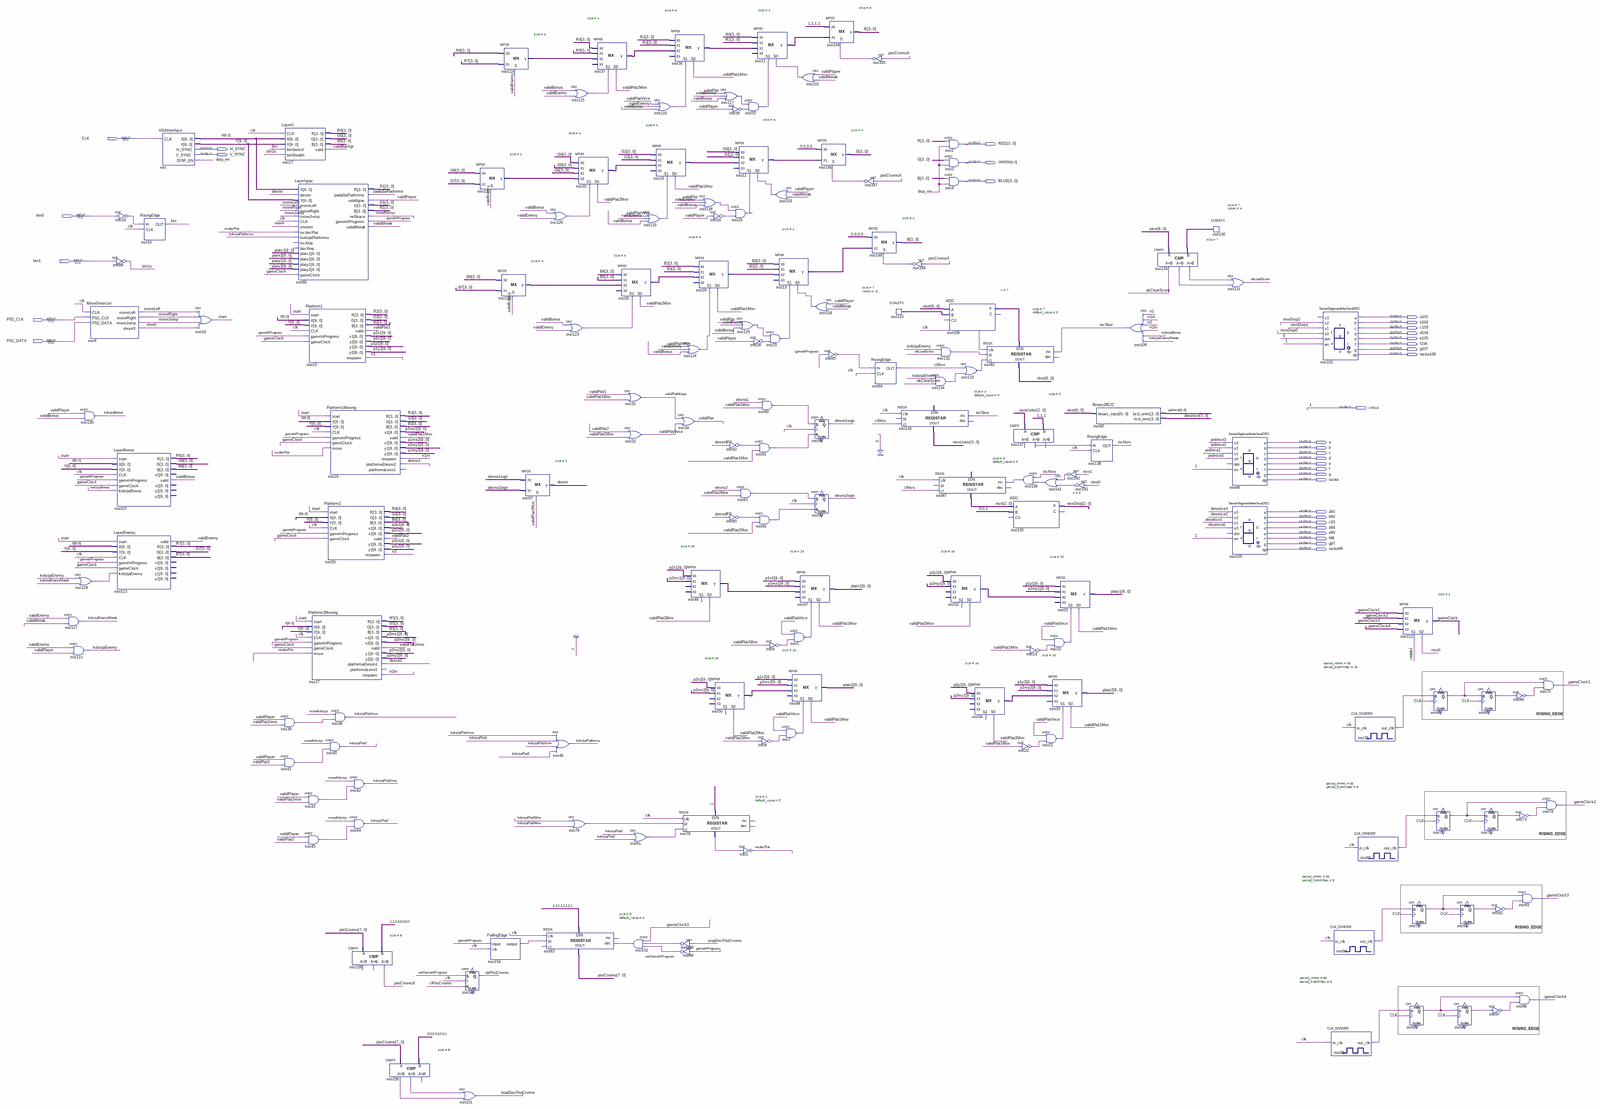
[diagram p0: schematic sheet, whole]
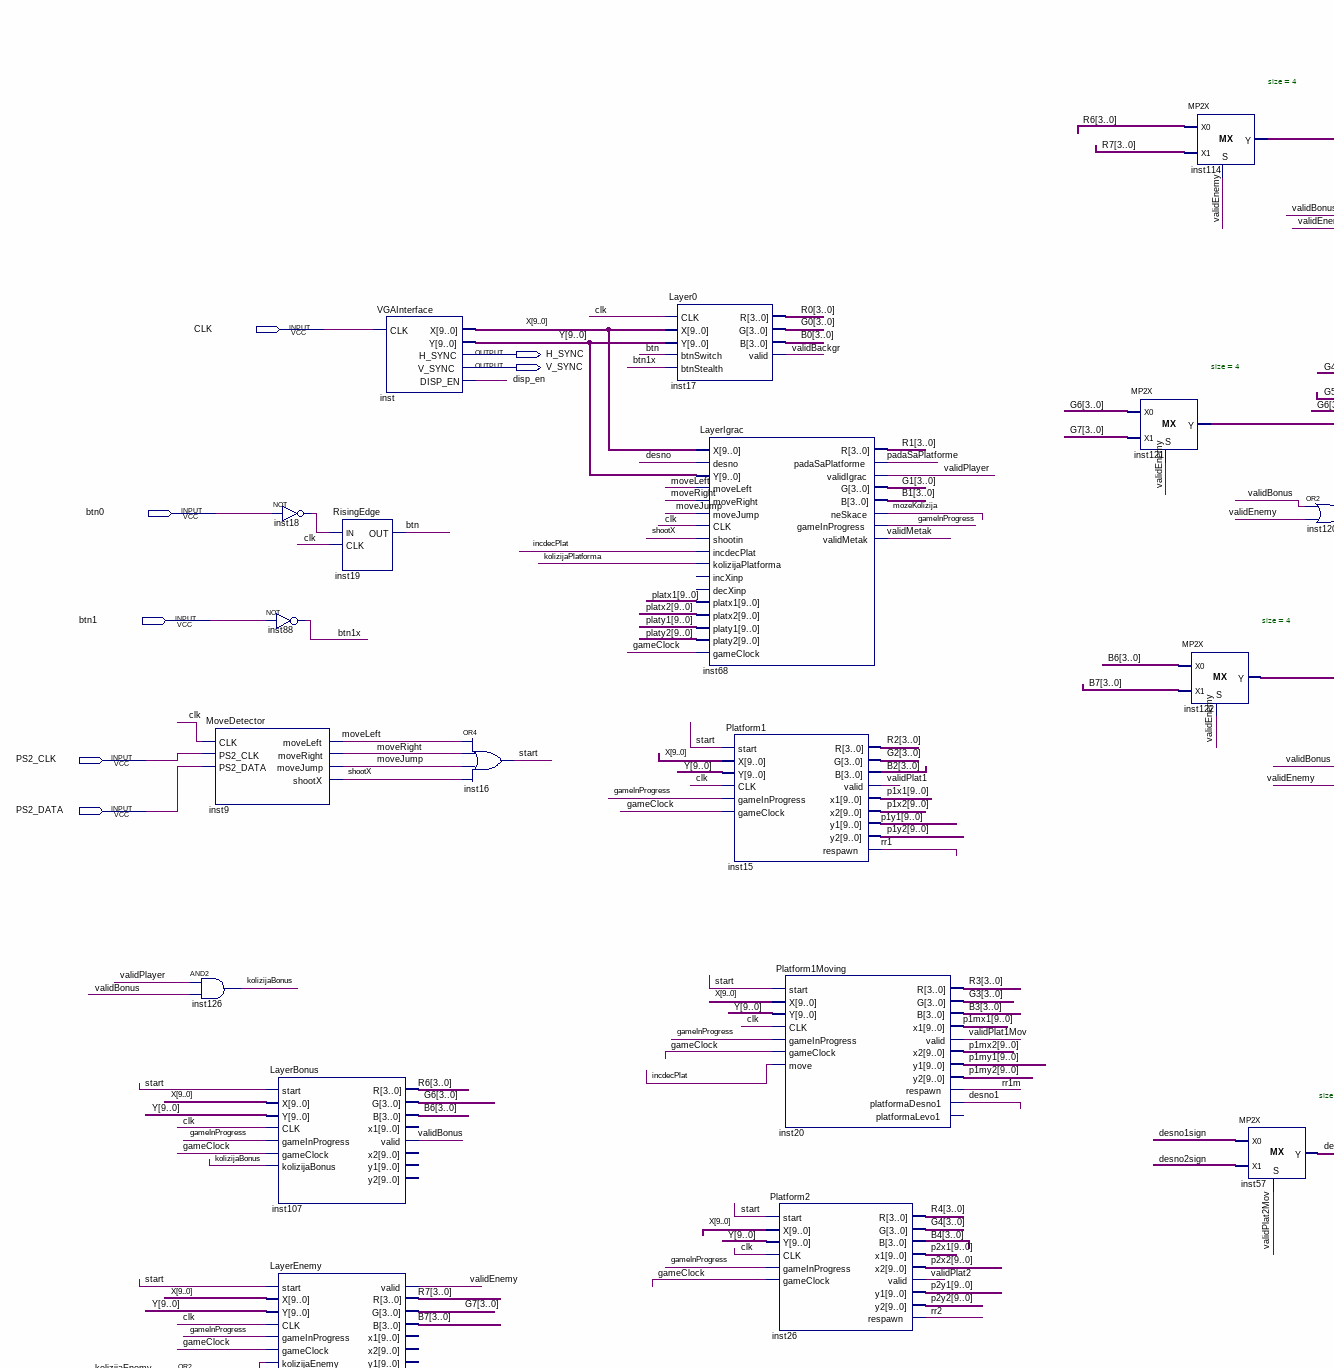
[diagram p1: schematic sheet, upper left part]
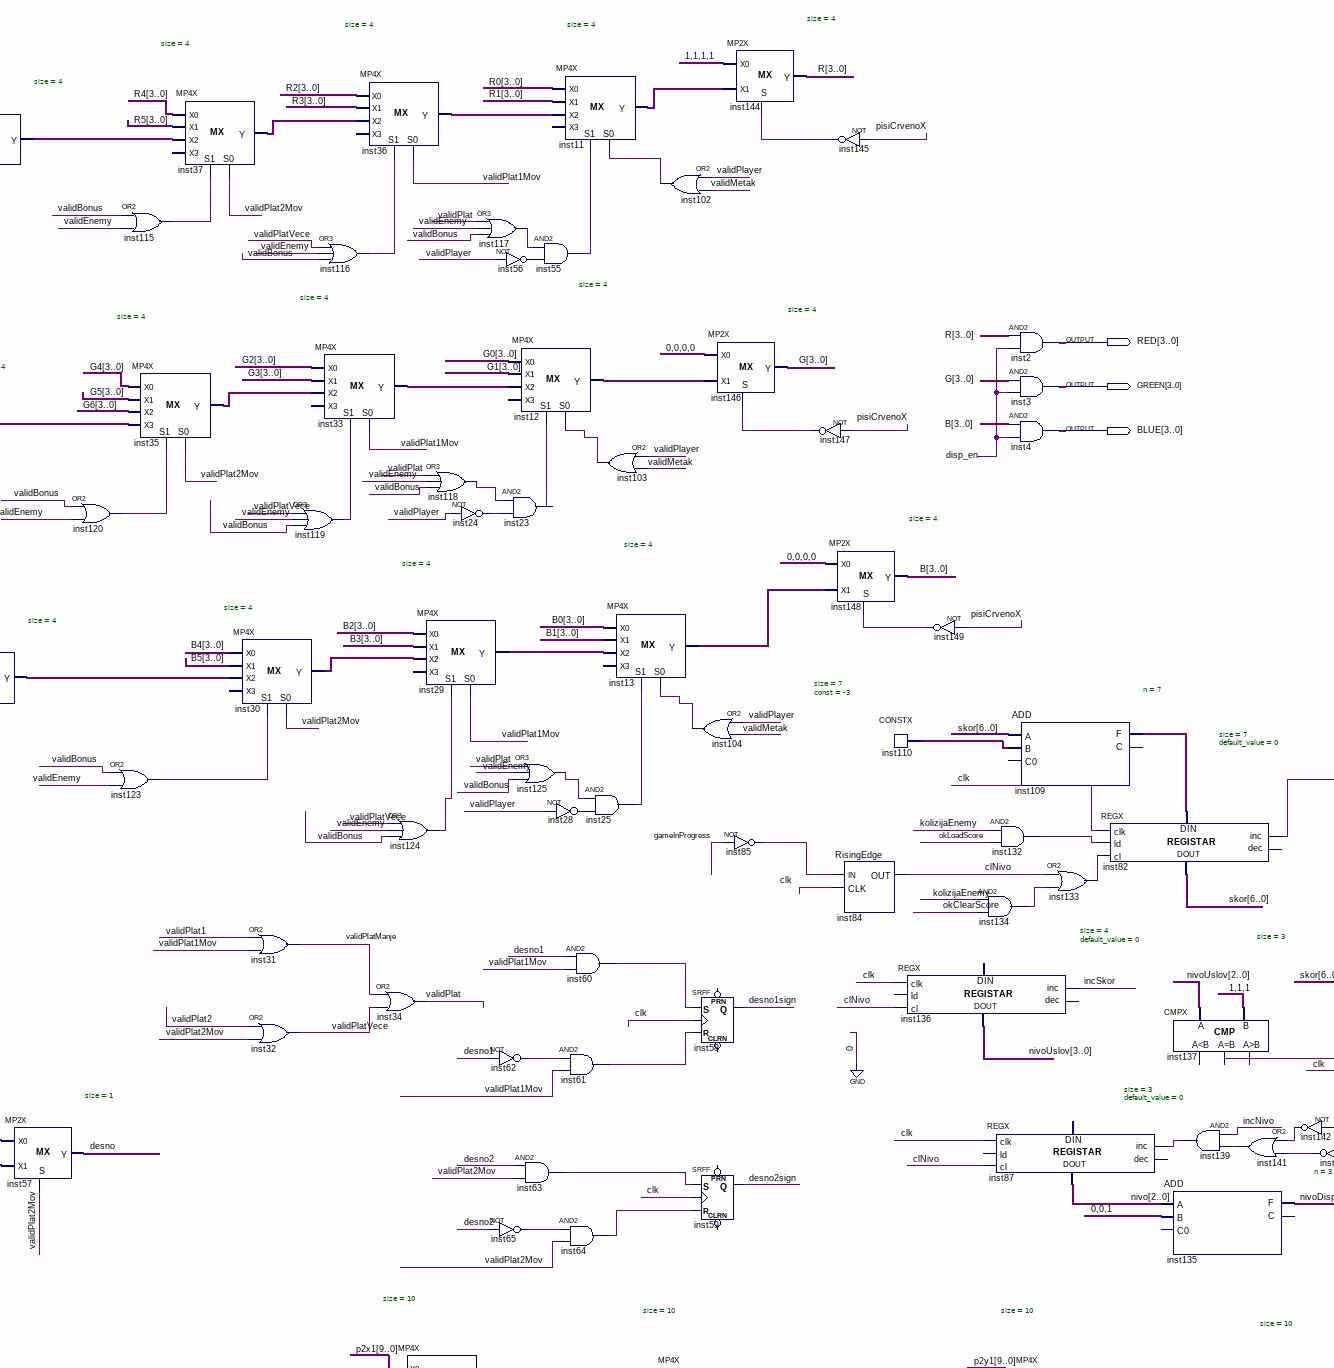
[diagram p2: schematic sheet, upper centre part]
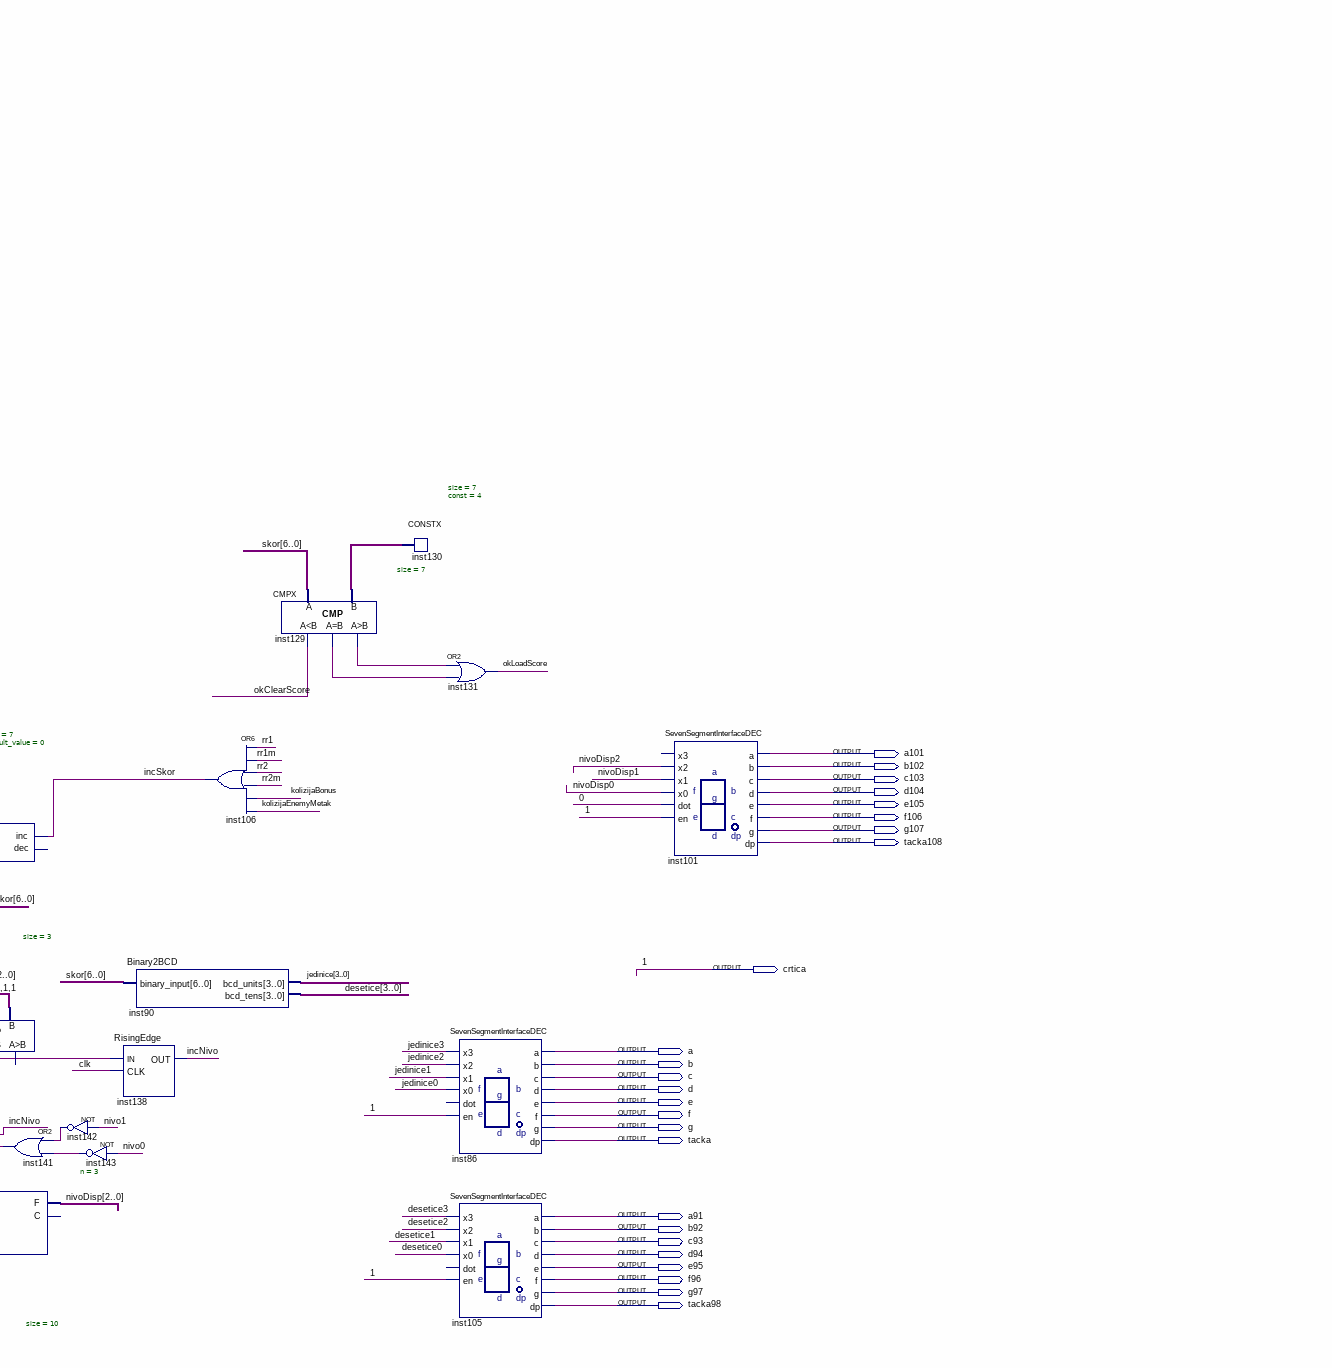
[diagram p3: schematic sheet, upper right part]
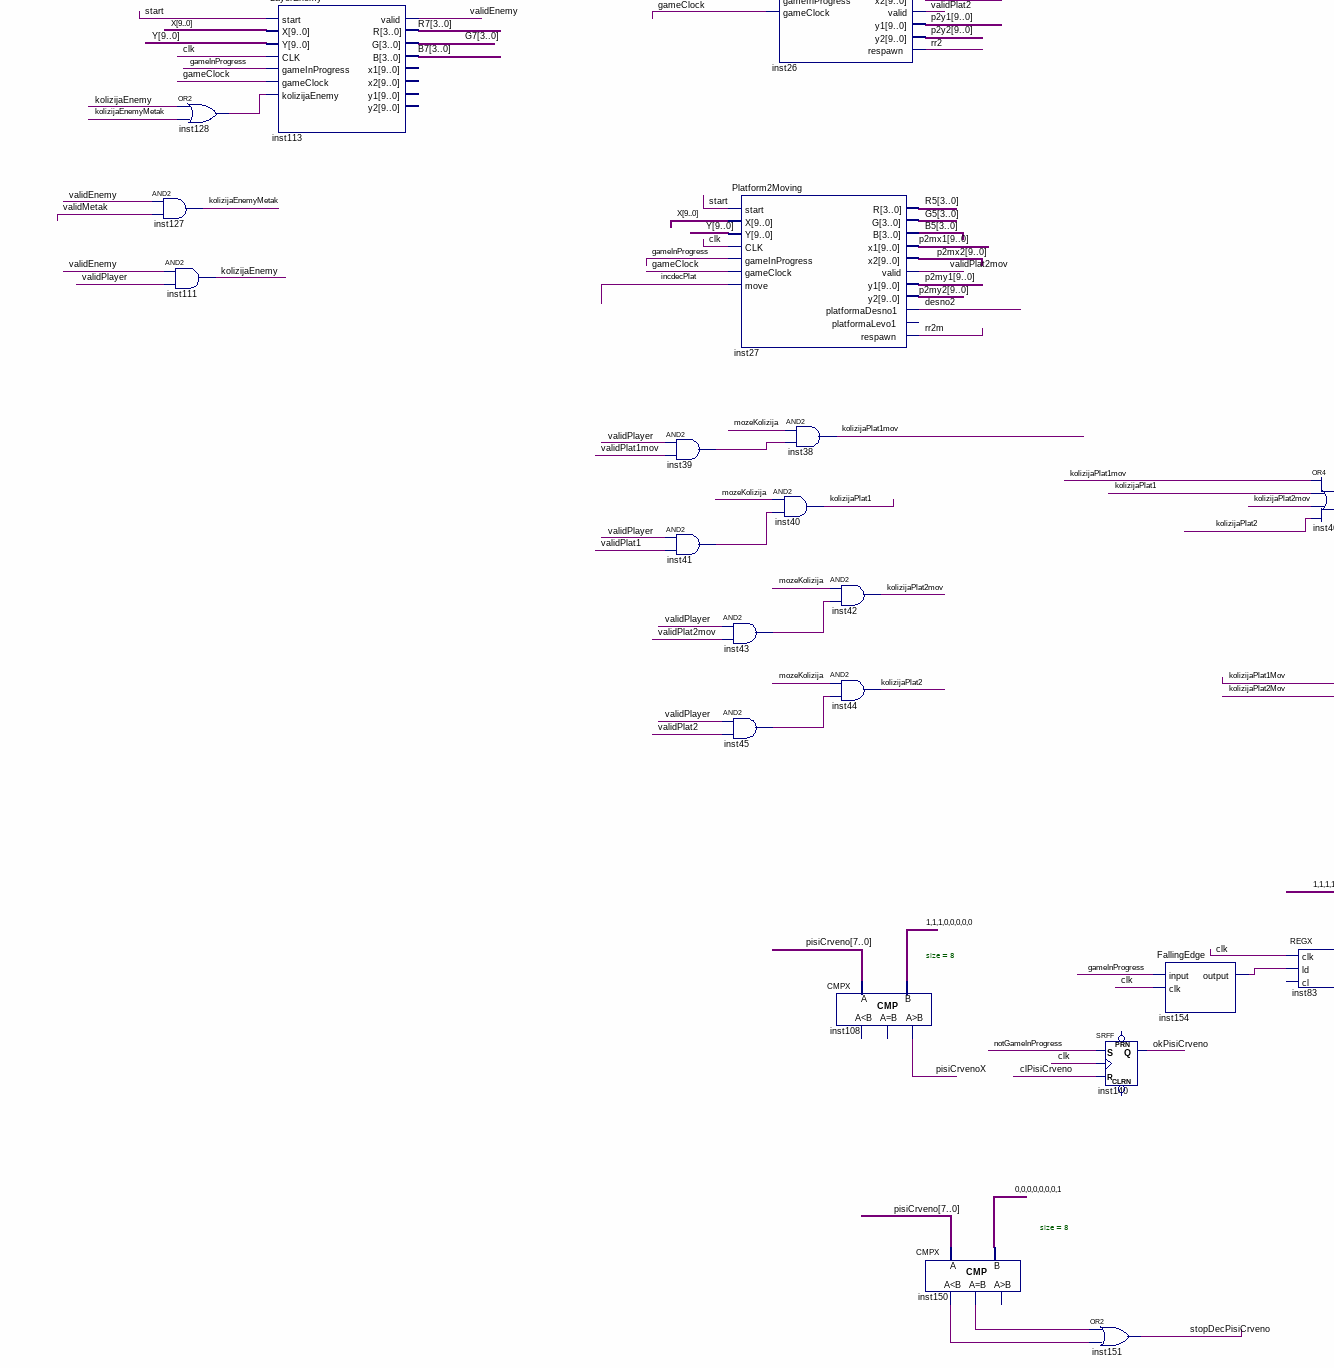
[diagram p4: schematic sheet, lower left part]
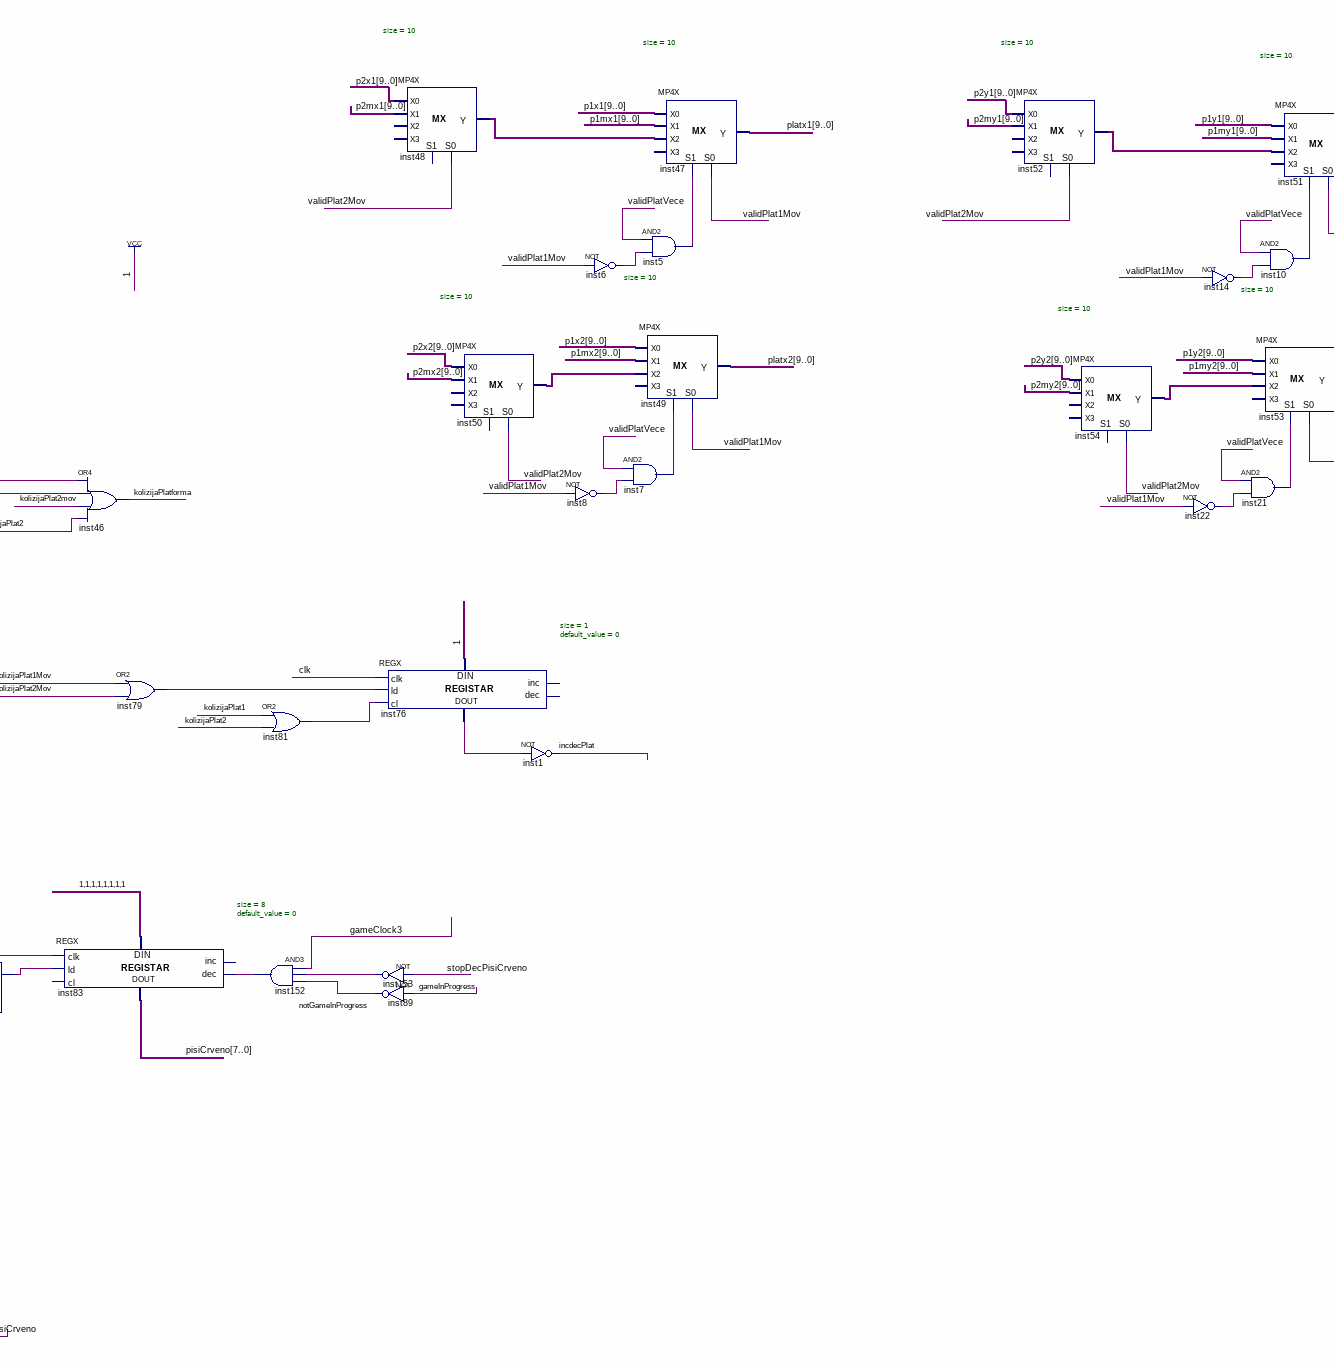
[diagram p5: schematic sheet, lower centre part]
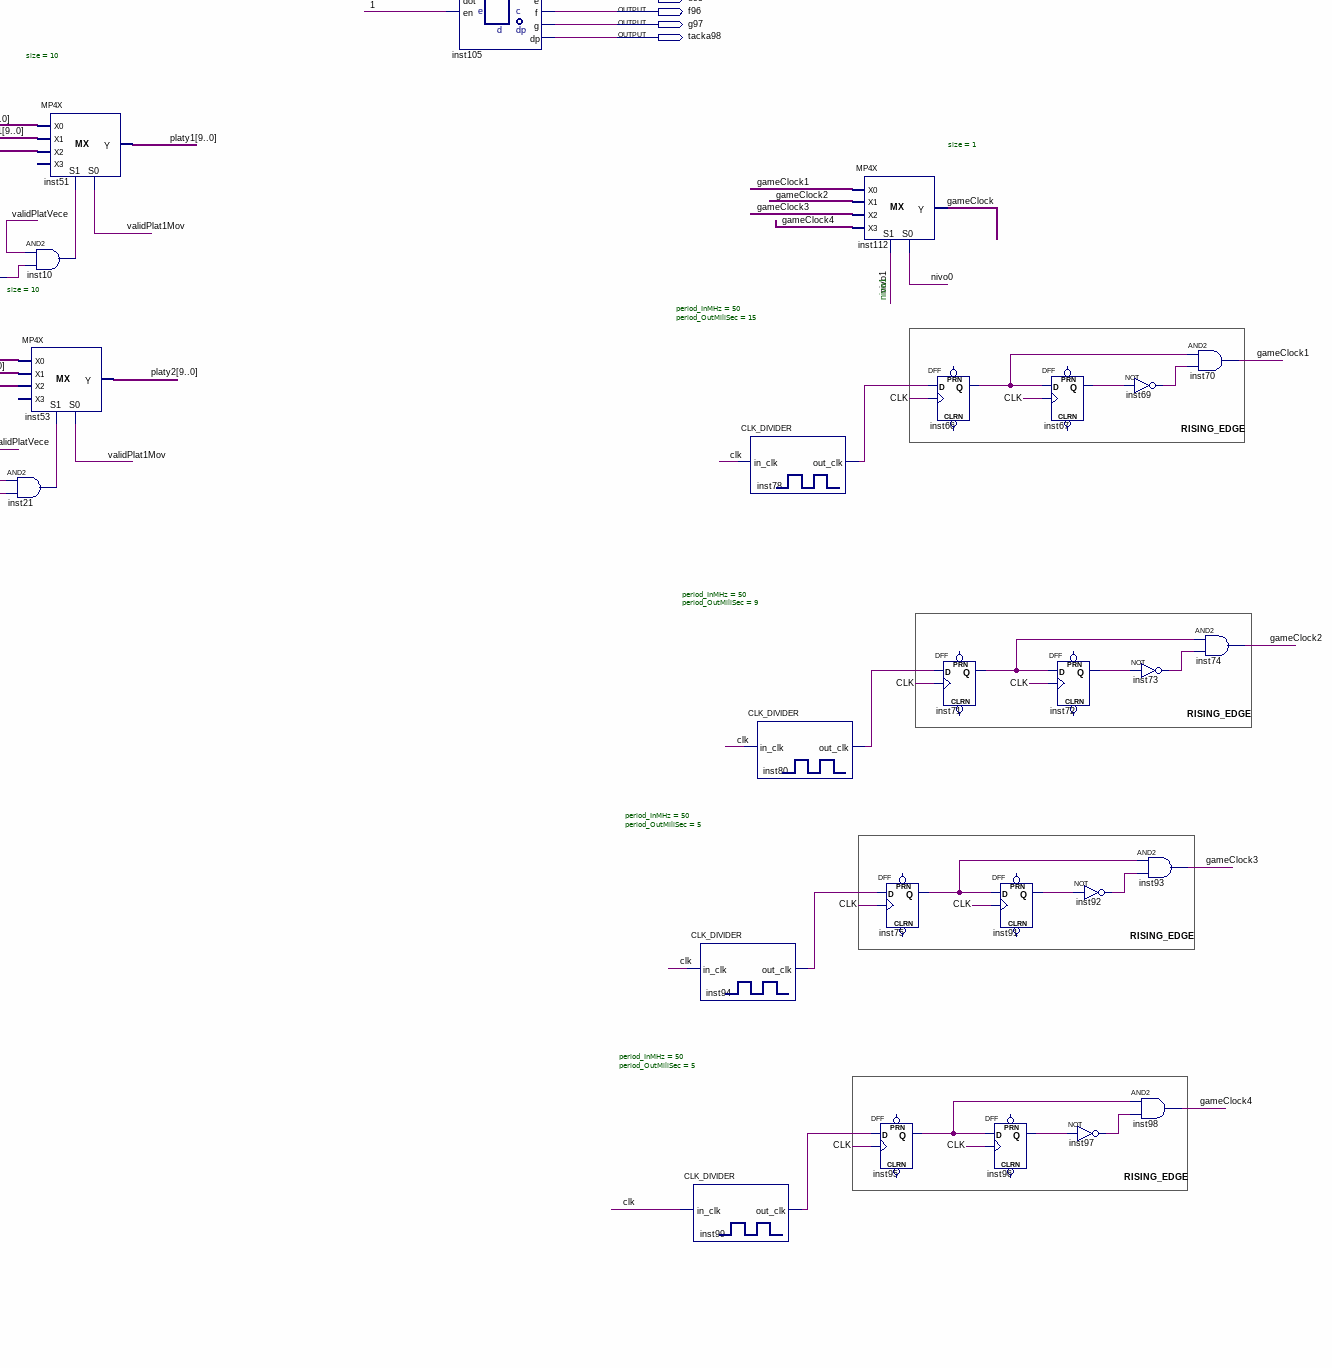
[diagram p6: schematic sheet, lower right part]
// Quartus schematic ProjekatNovo.bdf as structural Verilog: 153 symbols, 35 pins
module ProjekatNovo (
  input  CLK,
  input  btn0,
  input  btn1,
  input  PS2_CLK,
  input  PS2_DATA,
  output [3:0] RED,
  output H_SYNC,
  output V_SYNC,
  output [3:0] GREEN,
  output [3:0] BLUE,
  output a101,
  output b102,
  output c103,
  output d104,
  output e105,
  output f106,
  output g107,
  output tacka108,
  output crtica,
  output a,
  output b,
  output c,
  output d,
  output e,
  output f,
  output g,
  output tacka,
  output a91,
  output b92,
  output c93,
  output d94,
  output e95,
  output f96,
  output g97,
  output tacka98
);

  wire btn, btn1x, clNivo, clPisiCrveno, desno, desno1, desno1sign, desno2, desno2sign, disp_en, gameClock,
       gameClock1, gameClock2, gameClock3, gameClock4, gameInProgress, incdecPlat, incNivo, incSkor,
       inst5_out, inst6_out, inst7_out, inst8_out, inst10_out, inst14_out, inst18_out, inst21_out,
       inst22_out, inst23_out, inst24_out, inst25_out, inst28_out, inst39_out, inst41_out, inst43_out,
       inst45_out, inst55_out, inst56_out, inst60_out, inst61_out, inst62_out, inst63_out, inst64_out,
       inst65_out, inst66_q, inst67_q, inst69_out, inst71_q, inst72_q, inst73_out, inst75_q, inst76_data_out,
       inst78_out_clk, inst79_out, inst80_out_clk, inst81_out, inst85_out, inst91_q, inst92_out,
       inst94_out_clk, inst95_q, inst96_q, inst97_out, inst99_out_clk, inst102_out, inst103_out, inst104_out,
       inst115_out, inst116_out, inst117_out, inst118_out, inst119_out, inst120_out, inst123_out,
       inst124_out, inst125_out, inst128_out, inst129_eq, inst129_gr, inst132_out, inst133_out, inst134_out,
       inst137_eq, inst139_out, inst141_out, inst142_out, inst143_out, inst145_out, inst147_out, inst149_out,
       inst150_eq, inst150_ls, inst152_out, inst153_out, inst154_output, kolizijaBonus, kolizijaEnemy,
       kolizijaEnemyMetak, kolizijaPlat1, kolizijaPlat1mov, kolizijaPlat2, kolizijaPlat2mov,
       kolizijaPlatforma, moveJump, moveLeft, moveRight, mozeKolizija, notGameInProgress, okClearScore,
       okLoadScore, okPisiCrveno, padaSaPlatforme, pisiCrvenoX, rr1, rr1m, rr2, rr2m, shootX, start,
       stopDecPisiCrveno, validBackgr, validBonus, validEnemy, validMetak, validPlat, validPlat1,
       validPlat1Mov, validPlat2, validPlat2Mov, validPlatManje, validPlatVece, validPlayer;
  wire [2:0] nivo, nivoDisp;
  wire [3:0] B0, B1, B2, B3, B4, B5, B6, B7, b_bus, desetice, G0, G1, G2, G3, G4, G5, G6, G7, g_bus,
       inst11_y, inst12_y, inst13_y, inst29_y, inst30_y, inst33_y, inst35_y, inst36_y, inst37_y, inst114_y,
       inst121_y, inst122_y, jedinice, nivoUslov, R, R0, R1, R2, R3, R4, R5, R6, R7;
  wire [6:0] inst109_f, inst110_data, inst130_data, skor;
  wire [7:0] pisiCrveno;
  wire [9:0] inst48_y, inst50_y, inst52_y, inst54_y, p1mx1, p1mx2, p1my1, p1my2, p1x1, p1x2, p1y1, p1y2,
       p2mx1, p2mx2, p2my1, p2my2, p2x1, p2x2, p2y1, p2y2, platx1, platx2, platy1, platy2, X, Y;

  and inst127 (kolizijaEnemyMetak, validEnemy, validMetak);
  MoveDetector inst9 (
    .CLK(CLK), .PS2_CLK(PS2_CLK), .PS2_DATA(PS2_DATA), .moveLeft(moveLeft), .moveRight(moveRight),
    .moveJump(moveJump), .shootX(shootX));
  and inst126 (kolizijaBonus, validPlayer, validBonus);
  or inst128 (inst128_out, kolizijaEnemy, kolizijaEnemyMetak);
  and inst111 (kolizijaEnemy, validEnemy, validPlayer);
  not inst18 (inst18_out, btn0);
  not inst88 (btn1x, btn1);
  LayerBonus inst107 (
    .start(start), .X(X), .Y(Y), .CLK(CLK), .gameInProgress(gameInProgress), .gameClock(gameClock),
    .kolizijaBonus(kolizijaBonus), .R(R6), .G(G6), .B(B6), .valid(validBonus));  // open: x1, x2, y1, y2
  LayerEnemy inst113 (
    .start(start), .X(X), .Y(Y), .CLK(CLK), .gameInProgress(gameInProgress), .gameClock(gameClock),
    .kolizijaEnemy(inst128_out), .valid(validEnemy), .R(R7), .G(G7), .B(B7));  // open: x1, x2, y1, y2
  RisingEdge inst19 (.IN(inst18_out), .CLK(CLK), .OUT(btn));
  VGAInterface inst (.CLK(CLK), .X(X), .Y(Y), .H_SYNC(H_SYNC), .V_SYNC(V_SYNC), .DISP_EN(disp_en));
  or inst16 (start, moveLeft, moveRight, moveJump, shootX);
  Layer0 inst17 (
    .CLK(CLK), .X(X), .Y(Y), .btnSwitch(btn), .btnStealth(btn1x), .R(R0), .G(G0), .B(B0), .valid(validBackgr));
  and inst39 (inst39_out, validPlayer, validPlat1Mov);
  and inst41 (inst41_out, validPlayer, validPlat1);
  LayerIgrac inst68 (
    .X(X), .desno(desno), .Y(Y), .moveLeft(moveLeft), .moveRight(moveRight), .moveJump(moveJump), .CLK(CLK),
    .shootin(shootX), .incdecPlat(incdecPlat), .kolizijaPlatforma(kolizijaPlatforma), .platx1(platx1),
    .platx2(platx2), .platy1(platy1), .platy2(platy2), .gameClock(gameClock), .R(R1),
    .padaSaPlatforme(padaSaPlatforme), .validIgrac(validPlayer), .G(G1), .B(B1), .neSkace(mozeKolizija),
    .gameInProgress(gameInProgress), .validMetak(validMetak));  // open: incXinp, decXinp
  Platform1 inst15 (
    .start(start), .X(X), .Y(Y), .CLK(CLK), .gameInProgress(gameInProgress), .gameClock(gameClock), .R(R2),
    .G(G2), .B(B2), .valid(validPlat1), .x1(p1x1), .x2(p1x2), .y1(p1y1), .y2(p1y2), .respawn(rr1));
  Platform2 inst26 (
    .start(start), .X(X), .Y(Y), .CLK(CLK), .gameInProgress(gameInProgress), .gameClock(gameClock), .R(R4),
    .G(G4), .B(B4), .x1(p2x1), .x2(p2x2), .valid(validPlat2), .y1(p2y1), .y2(p2y2), .respawn(rr2));
  Platform2Moving inst27 (
    .start(start), .X(X), .Y(Y), .CLK(CLK), .gameInProgress(gameInProgress), .gameClock(gameClock),
    .move(incdecPlat), .R(R5), .G(G5), .B(B5), .x1(p2mx1), .x2(p2mx2), .valid(validPlat2Mov), .y1(p2my1),
    .y2(p2my2), .platformaDesno1(desno2), .respawn(rr2m));  // open: platformaLevo1
  and inst43 (inst43_out, validPlayer, validPlat2Mov);
  and inst45 (inst45_out, validPlayer, validPlat2);
  Platform1Moving inst20 (
    .start(start), .X(X), .Y(Y), .CLK(CLK), .gameInProgress(gameInProgress), .gameClock(gameClock),
    .move(incdecPlat), .R(R3), .G(G3), .B(B3), .x1(p1mx1), .valid(validPlat1Mov), .x2(p1mx2), .y1(p1my1),
    .y2(p1my2), .respawn(rr1m), .platformaDesno1(desno1));  // open: platformaLevo1
  and inst38 (kolizijaPlat1mov, mozeKolizija, inst39_out);
  and inst40 (kolizijaPlat1, mozeKolizija, inst41_out);
  and inst42 (kolizijaPlat2mov, mozeKolizija, inst43_out);
  and inst44 (kolizijaPlat2, mozeKolizija, inst45_out);
  CMPX #(.size(8)) inst108 (.A(pisiCrveno), .B(8'b11100000), .gr(pisiCrvenoX));  // open: ls, eq
  CMPX #(.size(8)) inst150 (.A(pisiCrveno), .B(8'b00000001), .ls(inst150_ls), .eq(inst150_eq));  // open: gr
  SRFF inst140 (.S(notGameInProgress), .R(clPisiCrveno), .CLK(CLK), .Q(okPisiCrveno));  // open: PRN, CLRN
  or inst151 (stopDecPisiCrveno, inst150_eq, inst150_ls);
  MP2X #(.size(4)) inst121 (.S(validEnemy), .X0(G6), .X1(G7), .Y(inst121_y));
  FallingEdge inst154 (.\input (gameInProgress), .clk(CLK), .\output (inst154_output));
  MP2X #(.size(4)) inst114 (.S(validEnemy), .X0(R6), .X1(R7), .Y(inst114_y));
  MP2X #(.size(4)) inst122 (.S(validEnemy), .X0(B6), .X1(B7), .Y(inst122_y));
  MP2X #(.size(1)) inst57 (.S(validPlat2Mov), .X0(desno1sign), .X1(desno2sign), .Y(desno));
  or inst120 (inst120_out, validBonus, validEnemy);
  or inst46 (kolizijaPlatforma, kolizijaPlat1mov, kolizijaPlat1, kolizijaPlat2mov, kolizijaPlat2);
  REGX #(.size(8), .default_value(0)) inst83 (
    .clk(CLK), .ld(inst154_output), .dec(inst152_out), .data_in({8{1'b1}}), .data_out(pisiCrveno));  // open: cl, inc
  or inst115 (inst115_out, validBonus, validEnemy);
  MP4X #(.size(4)) inst35 (
    .S0(validPlat2Mov), .S1(inst120_out), .X0(G4), .X1(G5), .X2(G6), .X3(inst121_y), .Y(inst35_y));
  or inst123 (inst123_out, validBonus, validEnemy);
  or inst79 (inst79_out, kolizijaPlat1mov, kolizijaPlat2mov);
  MP4X #(.size(4)) inst37 (
    .S0(validPlat2Mov), .S1(inst115_out), .X0(R4), .X1(R5), .X2(inst114_y), .Y(inst37_y));  // open: X3
  MP4X #(.size(4)) inst30 (
    .S0(validPlat2Mov), .S1(inst123_out), .X0(B4), .X1(B5), .X2(inst122_y), .Y(inst30_y));  // open: X3
  or inst119 (inst119_out, validPlatVece, validEnemy, validBonus);
  or inst31 (validPlatManje, validPlat1, validPlat1Mov);
  or inst32 (validPlatVece, validPlat2, validPlat2Mov);
  or inst81 (inst81_out, kolizijaPlat1, kolizijaPlat2);
  and inst152 (inst152_out, gameClock3, inst153_out, notGameInProgress);
  or inst116 (inst116_out, validPlatVece, validEnemy, validBonus);
  MP4X #(.size(4)) inst33 (
    .S0(validPlat1Mov), .S1(inst119_out), .X0(G2), .X1(G3), .X2(inst35_y), .Y(inst33_y));  // open: X3
  MP4X #(.size(4)) inst36 (
    .S0(validPlat1Mov), .S1(inst116_out), .X0(R2), .X1(R3), .X2(inst37_y), .Y(inst36_y));  // open: X3
  or inst124 (inst124_out, validPlatVece, validEnemy, validBonus);
  or inst34 (validPlat, validPlatManje, validPlatVece);
  MP4X #(.size(10)) inst48 (.S0(validPlat2Mov), .X0(p2x1), .X1(p2mx1), .Y(inst48_y));  // open: S1, X2, X3
  REGX #(.size(1), .default_value(0)) inst76 (
    .clk(CLK), .ld(inst79_out), .cl(inst81_out), .data_in(1'b1), .data_out(inst76_data_out));  // open: inc, dec
  not inst153 (inst153_out, stopDecPisiCrveno);
  not inst89 (notGameInProgress, gameInProgress);
  or inst118 (inst118_out, validPlat, validEnemy, validBonus);
  MP4X #(.size(4)) inst29 (
    .S0(validPlat1Mov), .S1(inst124_out), .X0(B2), .X1(B3), .X2(inst30_y), .Y(inst29_y));  // open: X3
  or inst117 (inst117_out, validPlat, validEnemy, validBonus);
  not inst56 (inst56_out, validPlayer);
  not inst24 (inst24_out, validPlayer);
  not inst62 (inst62_out, desno1);
  not inst65 (inst65_out, desno2);
  MP4X #(.size(10)) inst50 (.S0(validPlat2Mov), .X0(p2x2), .X1(p2mx2), .Y(inst50_y));  // open: S1, X2, X3
  and inst55 (inst55_out, inst117_out, inst56_out);
  MP4X #(.size(4)) inst12 (
    .S0(inst103_out), .S1(inst23_out), .X0(G0), .X1(G1), .X2(inst33_y), .Y(inst12_y));  // open: X3
  and inst23 (inst23_out, inst118_out, inst24_out);
  or inst125 (inst125_out, validPlat, validEnemy, validBonus);
  not inst28 (inst28_out, validPlayer);
  and inst63 (inst63_out, desno2, validPlat2Mov);
  not inst1 (incdecPlat, inst76_data_out);
  MP4X #(.size(4)) inst11 (
    .S0(inst102_out), .S1(inst55_out), .X0(R0), .X1(R1), .X2(inst36_y), .Y(inst11_y));  // open: X3
  or inst103 (inst103_out, validPlayer, validMetak);
  and inst25 (inst25_out, inst125_out, inst28_out);
  and inst60 (inst60_out, desno1, validPlat1Mov);
  and inst61 (inst61_out, inst62_out, validPlat1Mov);
  and inst64 (inst64_out, inst65_out, validPlat2Mov);
  not inst6 (inst6_out, validPlat1Mov);
  not inst8 (inst8_out, validPlat1Mov);
  MP4X #(.size(4)) inst13 (
    .S0(inst104_out), .S1(inst25_out), .X0(B0), .X1(B1), .X2(inst29_y), .Y(inst13_y));  // open: X3
  and inst5 (inst5_out, validPlatVece, inst6_out);
  MP4X #(.size(10)) inst49 (
    .S0(validPlat1Mov), .S1(inst7_out), .X0(p1x2), .X1(p1mx2), .X2(inst50_y), .Y(platx2));  // open: X3
  and inst7 (inst7_out, validPlatVece, inst8_out);
  or inst102 (inst102_out, validPlayer, validMetak);
  or inst104 (inst104_out, validPlayer, validMetak);
  SRFF inst58 (.S(inst60_out), .R(inst61_out), .CLK(CLK), .Q(desno1sign));  // open: PRN, CLRN
  SRFF inst59 (.S(inst63_out), .R(inst64_out), .CLK(CLK), .Q(desno2sign));  // open: PRN, CLRN
  MP4X #(.size(10)) inst47 (
    .S0(validPlat1Mov), .S1(inst5_out), .X0(p1x1), .X1(p1mx1), .X2(inst48_y), .Y(platx1));  // open: X3
  MP2X #(.size(4)) inst144 (.S(inst145_out), .X0(4'b1111), .X1(inst11_y), .Y(R));
  MP2X #(.size(4)) inst146 (.S(inst147_out), .X0(4'b0000), .X1(inst12_y), .Y(g_bus));
  not inst85 (inst85_out, gameInProgress);
  not inst145 (inst145_out, pisiCrvenoX);
  not inst147 (inst147_out, pisiCrvenoX);
  MP2X #(.size(4)) inst148 (.S(inst149_out), .X0(4'b0000), .X1(inst13_y), .Y(b_bus));
  RisingEdge inst84 (.IN(inst85_out), .CLK(CLK), .OUT(clNivo));
  CONSTX #(.size(7), .\const (-3)) inst110 (.data(inst110_data));
  REGX #(.size(4), .default_value(0)) inst136 (
    .clk(CLK), .cl(clNivo), .inc(incSkor), .data_out(nivoUslov));  // open: ld, dec, data_in
  not inst149 (inst149_out, pisiCrvenoX);
  and inst132 (inst132_out, kolizijaEnemy, okLoadScore);
  and inst134 (inst134_out, kolizijaEnemy, okClearScore);
  REGX #(.size(3), .default_value(0)) inst87 (
    .clk(CLK), .cl(clNivo), .inc(inst139_out), .data_out(nivo));  // open: ld, dec, data_in
  assign RED = R & {4{disp_en}};  // AND2 inst2, 4 bits wide
  assign GREEN = g_bus & {4{disp_en}};  // AND2 inst3, 4 bits wide
  assign BLUE = b_bus & {4{disp_en}};  // AND2 inst4, 4 bits wide
  ADD #(.n(7)) inst109 (.A(skor), .B(inst110_data), .F(inst109_f));  // open: C0, C
  or inst133 (inst133_out, clNivo, inst134_out);
  MP4X #(.size(10)) inst52 (.S0(validPlat2Mov), .X0(p2y1), .X1(p2my1), .Y(inst52_y));  // open: S1, X2, X3
  REGX #(.size(7), .default_value(0)) inst82 (
    .clk(CLK), .ld(inst132_out), .cl(inst133_out), .inc(incSkor), .data_in(inst109_f), .data_out(skor));  // open: dec
  MP4X #(.size(10)) inst54 (.S0(validPlat2Mov), .X0(p2y2), .X1(p2my2), .Y(inst54_y));  // open: S1, X2, X3
  CMPX #(.size(3)) inst137 (.A(nivoUslov[2:0]), .B(3'b111), .eq(inst137_eq));  // open: ls, gr
  and inst139 (inst139_out, incNivo, inst141_out);
  ADD #(.n(3)) inst135 (.A(nivo), .B(3'b001), .F(nivoDisp));  // open: C0, C
  not inst14 (inst14_out, validPlat1Mov);
  not inst22 (inst22_out, validPlat1Mov);
  or inst141 (inst141_out, inst142_out, inst143_out);
  and inst10 (inst10_out, validPlatVece, inst14_out);
  MP4X #(.size(10)) inst53 (
    .S0(validPlat1Mov), .S1(inst21_out), .X0(p1y2), .X1(p1my2), .X2(inst54_y), .Y(platy2));  // open: X3
  and inst21 (inst21_out, validPlatVece, inst22_out);
  not inst142 (inst142_out, nivo[1]);
  MP4X #(.size(10)) inst51 (
    .S0(validPlat1Mov), .S1(inst10_out), .X0(p1y1), .X1(p1my1), .X2(inst52_y), .Y(platy1));  // open: X3
  Binary2BCD inst90 (.binary_input(skor), .bcd_units(jedinice), .bcd_tens(desetice));
  RisingEdge inst138 (.IN(inst137_eq), .CLK(CLK), .OUT(incNivo));
  not inst143 (inst143_out, nivo[0]);
  or inst106 (incSkor, rr1, rr1m, rr2, rr2m, kolizijaBonus, kolizijaEnemyMetak);
  CMPX #(.size(7)) inst129 (.A(skor), .B(inst130_data), .ls(okClearScore), .eq(inst129_eq), .gr(inst129_gr));
  CONSTX #(.size(7), .\const (4)) inst130 (.data(inst130_data));
  or inst131 (okLoadScore, inst129_gr, inst129_eq);
  SevenSegmentInterfaceDEC inst86 (
    .x3(jedinice[3]), .x2(jedinice[2]), .x1(jedinice[1]), .x0(jedinice[0]), .en(1'b1), .a(a), .b(b), .c(c),
    .d(d), .e(e), .f(f), .g(g), .dp(tacka));  // open: dot
  SevenSegmentInterfaceDEC inst105 (
    .x3(desetice[3]), .x2(desetice[2]), .x1(desetice[1]), .x0(desetice[0]), .en(1'b1), .a(a91), .b(b92),
    .c(c93), .d(d94), .e(e95), .f(f96), .g(g97), .dp(tacka98));  // open: dot
  SevenSegmentInterfaceDEC inst101 (
    .x2(nivoDisp[2]), .x1(nivoDisp[1]), .x0(nivoDisp[0]), .dot(1'b0), .en(1'b1), .a(a101), .b(b102),
    .c(c103), .d(d104), .e(e105), .f(f106), .g(g107), .dp(tacka108));  // open: x3
  CLK_DIVIDER #(.period_InMHz(50), .period_OutMiliSec(5)) inst99 (.in_clk(CLK), .out_clk(inst99_out_clk));
  CLK_DIVIDER #(.period_InMHz(50), .period_OutMiliSec(5)) inst94 (.in_clk(CLK), .out_clk(inst94_out_clk));
  CLK_DIVIDER #(.period_InMHz(50), .period_OutMiliSec(15)) inst78 (.in_clk(CLK), .out_clk(inst78_out_clk));
  CLK_DIVIDER #(.period_InMHz(50), .period_OutMiliSec(9)) inst80 (.in_clk(CLK), .out_clk(inst80_out_clk));
  MP4X #(.size(1)) inst112 (
    .S0(nivo[0]), .S1(nivo[1]), .X0(gameClock1), .X1(gameClock2), .X2(gameClock3), .X3(gameClock4),
    .Y(gameClock));
  DFF inst75 (.CLK(CLK), .D(inst94_out_clk), .Q(inst75_q));  // open: CLRN, PRN
  DFF inst95 (.CLK(CLK), .D(inst99_out_clk), .Q(inst95_q));  // open: CLRN, PRN
  DFF inst66 (.CLK(CLK), .D(inst78_out_clk), .Q(inst66_q));  // open: CLRN, PRN
  DFF inst71 (.CLK(CLK), .D(inst80_out_clk), .Q(inst71_q));  // open: CLRN, PRN
  DFF inst96 (.CLK(CLK), .D(inst95_q), .Q(inst96_q));  // open: CLRN, PRN
  DFF inst91 (.CLK(CLK), .D(inst75_q), .Q(inst91_q));  // open: CLRN, PRN
  DFF inst67 (.CLK(CLK), .D(inst66_q), .Q(inst67_q));  // open: CLRN, PRN
  DFF inst72 (.CLK(CLK), .D(inst71_q), .Q(inst72_q));  // open: CLRN, PRN
  not inst92 (inst92_out, inst91_q);
  not inst97 (inst97_out, inst96_q);
  not inst69 (inst69_out, inst67_q);
  not inst73 (inst73_out, inst72_q);
  and inst93 (gameClock3, inst75_q, inst92_out);
  and inst98 (gameClock4, inst95_q, inst97_out);
  and inst70 (gameClock1, inst66_q, inst69_out);
  and inst74 (gameClock2, inst71_q, inst73_out);

  assign crtica = 1'b1;

  // Notes on the sheet:
  //   nivo1
  //   RISING_EDGE
  //   RISING_EDGE
  //   RISING_EDGE
  //   RISING_EDGE
endmodule
